# Altium schematic sheet Sheet1.SchDoc
size A4
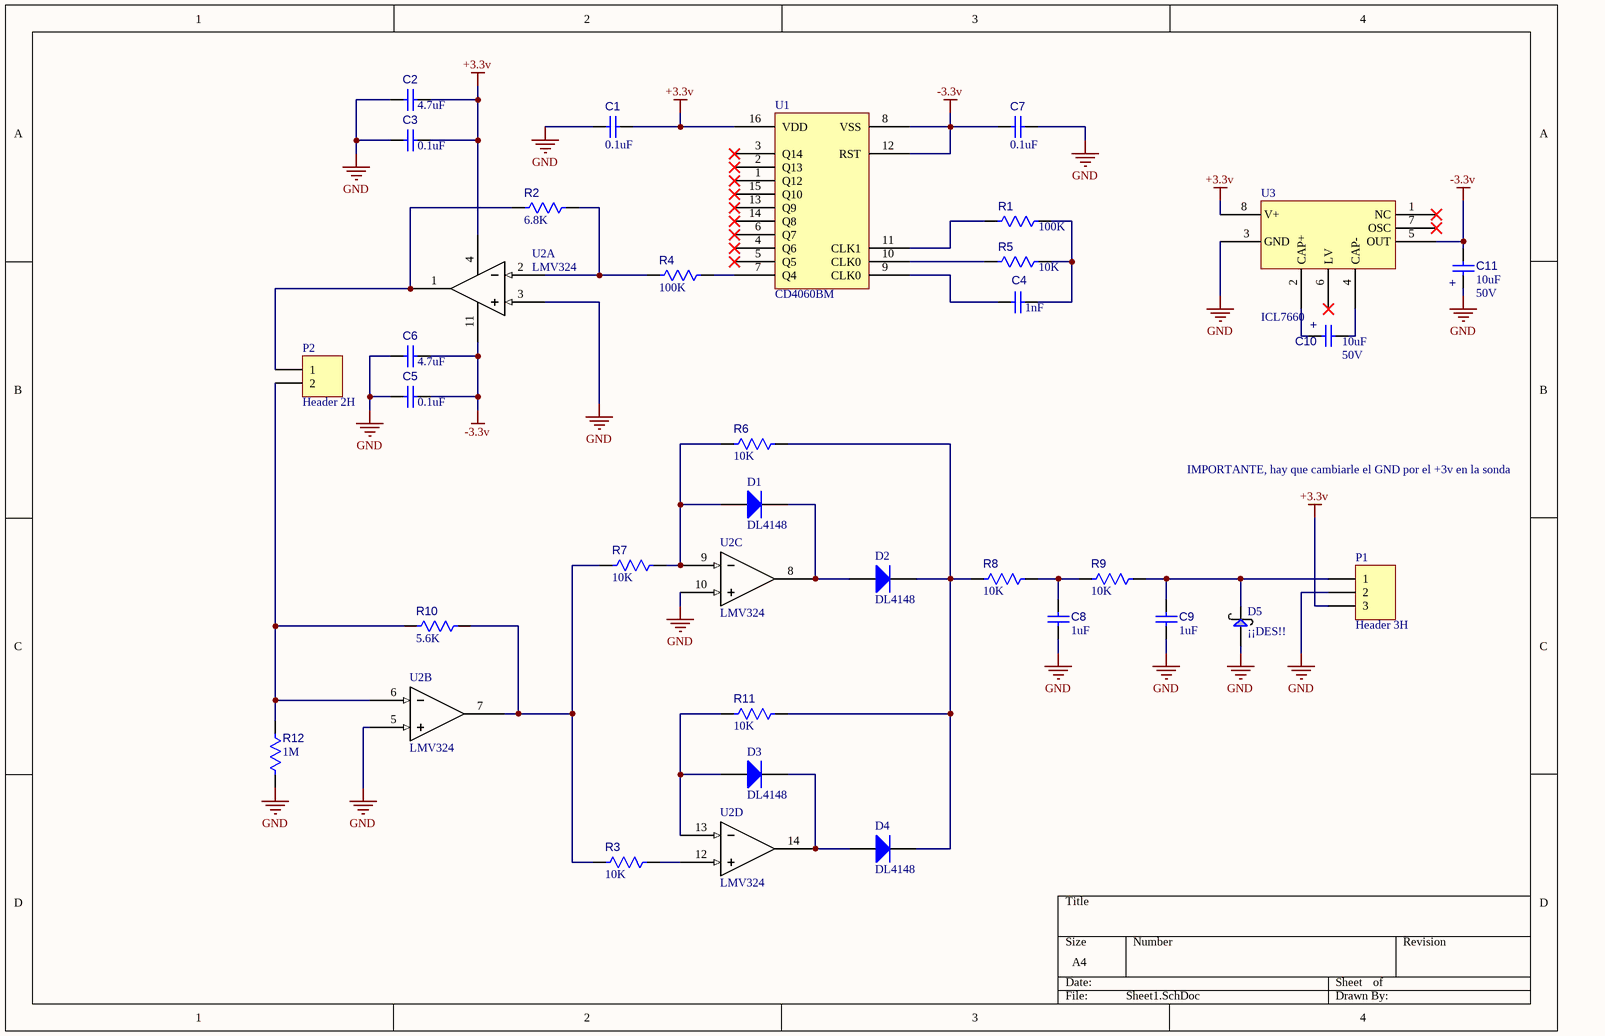
[diagram p0: Sheet1.SchDoc]

## Parts
C1  0.1uF  [0603]
C2  4.7uF  [0603]
C3  0.1uF  [0603]
C4  1nF  [0805]
C5  0.1uF  [0603]
C6  4.7uF  [0603]
C7  0.1uF  [0603]
C8  1uF  [0603]
C9  1uF  [0603]
C10  Voltage-Rated: 50V  [CAPC3216x130N]  (hidden comment: 10uF)
C11  Voltage-Rated: 50V  [CAPC3216x130N]  (hidden comment: 10uF)
D1  DL4148  [SOD80C]
D2  DL4148  [SOD80C]
D3  DL4148  [SOD80C]
D4  DL4148  [SOD80C]
D5  ¡¡DES!!  [DO214AC (SMA)]
P1  Header 3H  [HDR1X3H]
P2  Header 2H  [HDR1X2H]
R1  100K  [0603]
R2  6.8K  [0805]
R3  10K  [0603]
R4  100K  [0603]
R5  10K  [0603]
R6  10K  [0603]
R7  10K  [0603]
R8  10K  [0603]
R9  10K  [0603]
R10  5.6K  [0805]
R11  10K  [0603]
R12  1M  [0603]
U1  CD4060BM  [SO-16_N]
U2  LMV324  [SO-14_N]  (parts A,B,C,D of 4)
U3  ICL7660  [SO8_N]

## Nets
+3.3v: C1.2 C2.2 C3.2 P1.3 U1.16(VDD) U2.4 U3.8(V+)
-3.3v: C5.2 C6.1 C7.1 C11.2 U1.8(VSS) U1.12(RST) U2.11 U3.5(OUT)
GND: C1.1 C2.1 C3.1 C5.1 C6.2 C7.2 C8.2 C9.2 C11.1 D5.1 P1.2 R12.2 U2.3 U2.5 U2.10 U3.3(GND)
NetC4_1: C4.1 R1.1 R5.1
NetC4_2: C4.2 U1.9(CLK0)
NetC8_1: C8.1 R8.2 R9.1
NetC9_1: C9.1 D5.2 P1.1 R9.2
NetC10_1: C10.1 U3.2(CAP+)
NetC10_2: C10.2 U3.4(CAP-)
NetD1_1: D1.1(A) R6.1 R7.2 U2.9
NetD1_2: D1.2(K) D2.1(A) U2.8
NetD2_2: D2.2(K) D4.2(K) R6.2 R8.1 R11.2
NetD3_1: D3.1(A) R11.1 U2.13
NetD3_2: D3.2(K) D4.1(A) U2.14
NetP2_1: P2.1 R2.1 U2.1
NetP2_2: P2.2 R10.1 R12.1 U2.6
NetR1_2: R1.2 U1.11(CLK1)
NetR2_2: R2.2 R4.1 U2.2
NetR3_1: R3.1 R7.1 R10.2 U2.7
NetR3_2: R3.2 U2.12
NetR4_2: R4.2 U1.7(Q4)
NetR5_2: R5.2 U1.10(CLK0)

Not connected (* = marked no-connect by the designer): U1 1(Q12)* 2(Q13)* 3(Q14)* 4(Q6)* 5(Q5)* 6(Q7)* 13(Q9)* 14(Q8)* 15(Q10)*; U3 1(NC)* 6(LV)* 7(OSC)*

## Notes on the sheet
- IMPORTANTE, hay que cambiarle el GND por el +3v en la sonda
- (in symbol Cap Pol) +

## Library data of the parts
C1-C6 C8 C9 = Cap: Tolerance: ±10%; Voltage-Rated: 6.3V; Package: 0603
  C1 C3 C5: Value: 0.1uF
  C2 C6: Value: 4.7uF
  C4: Value: 1nF
  C8 C9: Value: 1uF
C7 = Cap: Tolerance: ±10%; Voltage-Rated: 50V; Package: 0603; Value: 0.1uF
C10 C11 = Cap Pol: Cap; Manufacturer: Panasonic; MfgPartNum: EEE-FC1H220P; Tolerance: ±10%; 3rdMfgr: Vishay / MAL214097103E3; Current: 90 mARMS; Package: 8mm dia.; Value: 10uF
D1-D4 = DL4148: Smal signal diode
D5 = B340A: SURFACE MOUNT SCHOTTKY BARRIER RECTIFIER 1N5829. Pueden ir varios de los de sech; Voltage-Rated: 40V; Value: B340A7otro; Package: DO214AA (SMB)
P1 = Header 3H: Header, 3-Pin, Right Angle; LatestRevisionDate: 17-Jul-2002; LatestRevisionNote: Re-released for DXP Platform.; Publisher: Altium Limited
P2 = Header 2H: Header, 2-Pin, Right Angle; LatestRevisionDate: 17-Jul-2002; LatestRevisionNote: Re-released for DXP Platform.; Publisher: Altium Limited
R1-R12 = Res: Resistor; Tolerance: 1%; Package: 0603
  R1 R4: Value: 100K
  R2: Value: 6.8K
  R3 R5-R9 R11: Value: 10K
  R10: Value: 5.6K
  R12: Value: 1M
U1 = CD4060: IC Counter Binary Counter Element Bit Negative Edge 16-SOIC
U2 = LMV324: General Purpose Amplifier Circuit Rail-to-Rail 14-SOIC
U3 = ICL7660: CMOS Voltage Converters, from positive to negative for an input range of +1.5V to +10.0V